# EAGLE schematic AirborneAce (EAGLE 9.6.2)
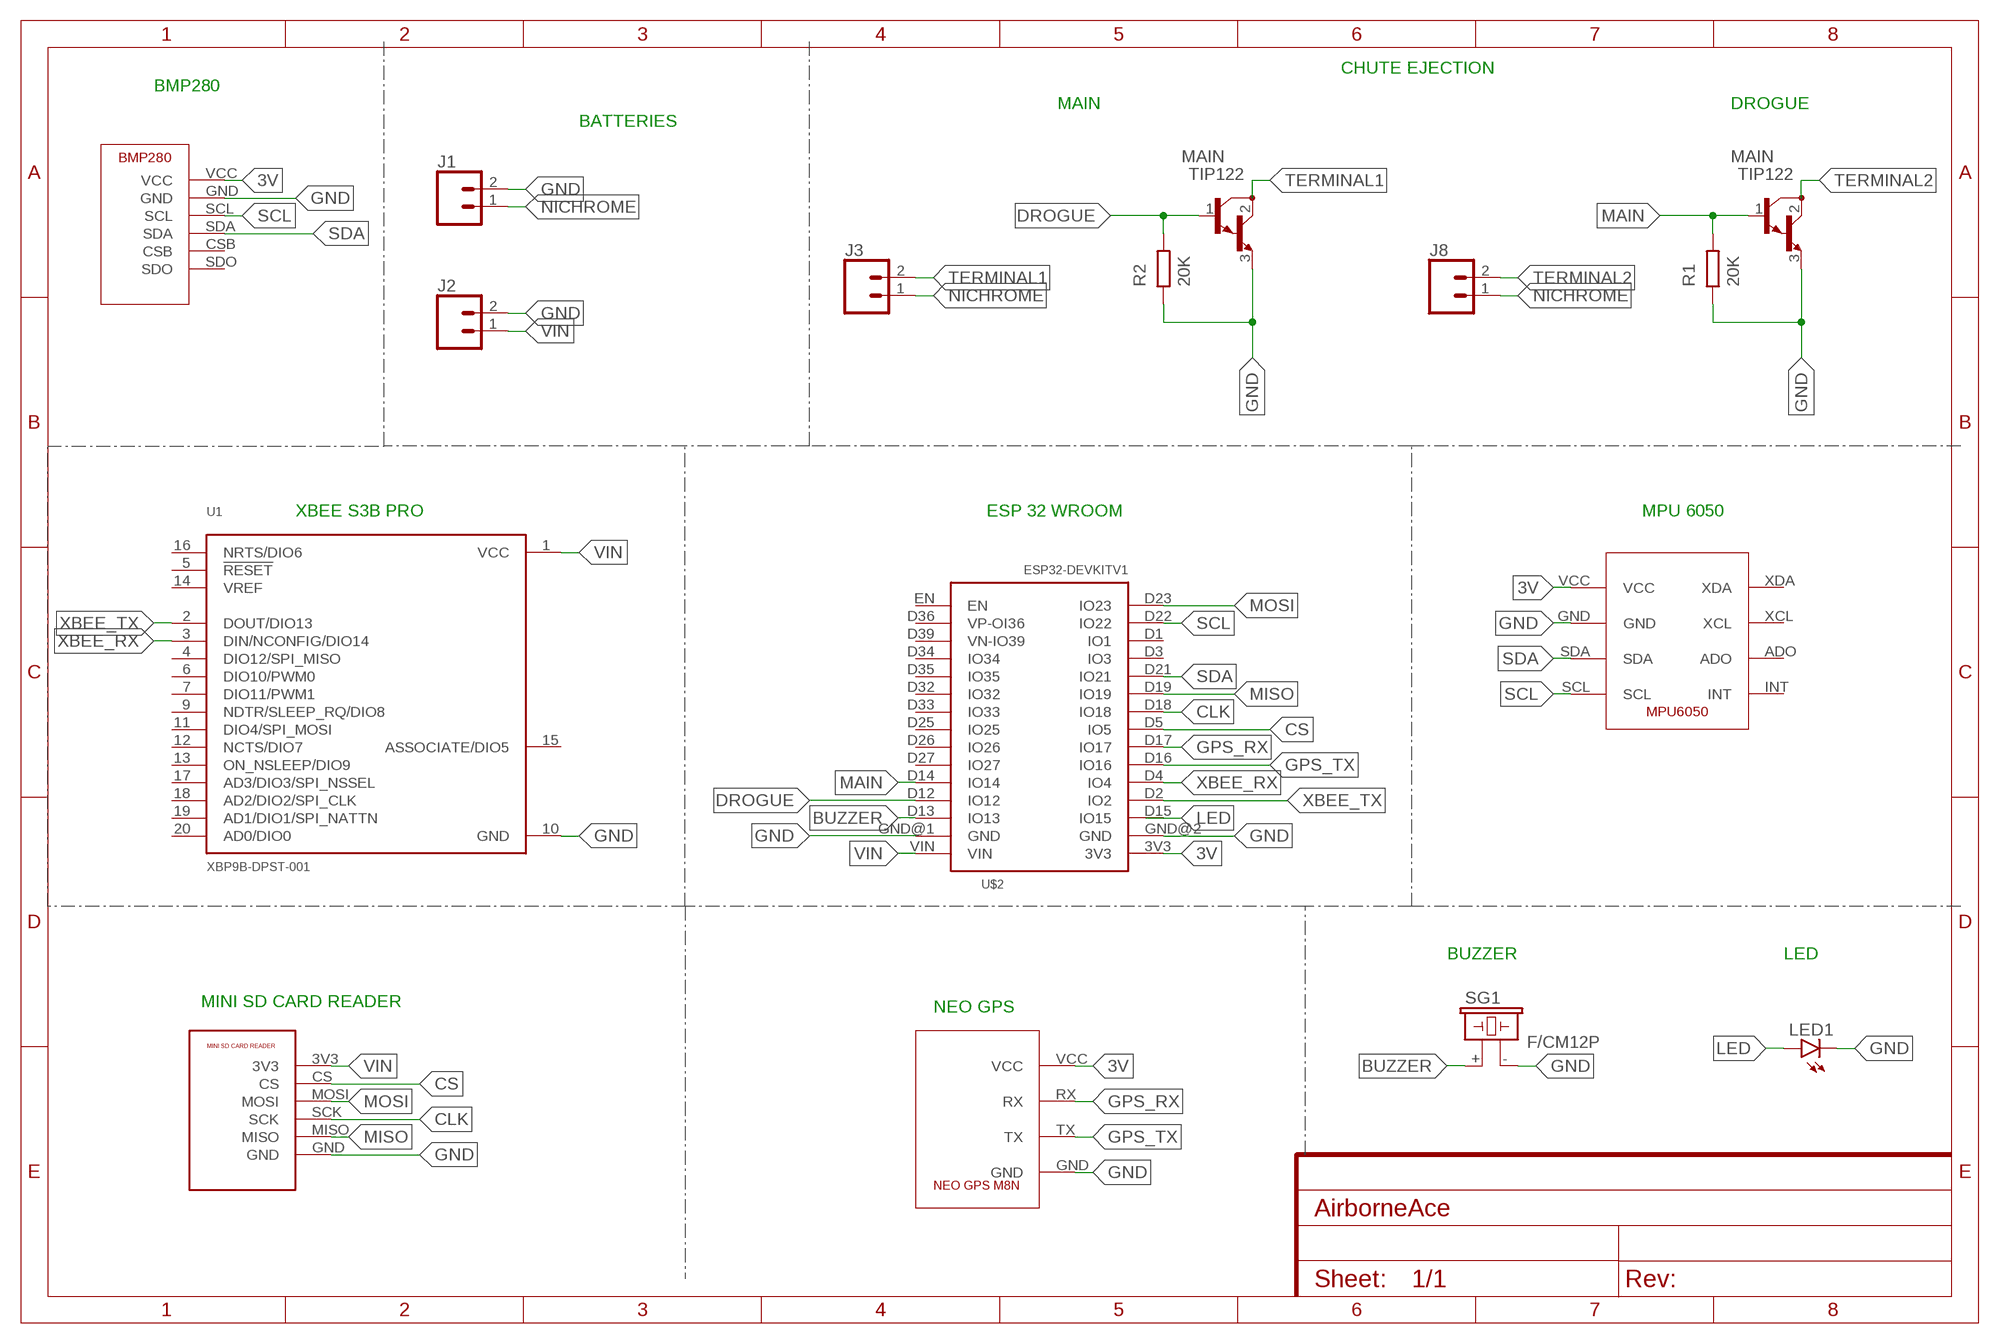
[diagram p0: schematic, sheet 1]

## Parts
J1  CONN_02PTH4  [1X02_XTRA_BIG]
J2  CONN_02PTH4  [1X02_XTRA_BIG]
J3  CONN_02PTH4  [1X02_XTRA_BIG]
J8  CONN_02PTH4  [1X02_XTRA_BIG]
LED1  LED3MM  [LED3MM]
Q1  TIP122  [TO220]
Q2  TIP122  [TO220]
R1  20K  R  (no package)
R2  20K  R  (no package)
SG1  F/CM12P  [F/CM12P]
U1  XBP9B-DPST-001  [DIP2200W51P200L3294H279Q20P]
U$1  MPU6050MPU6050  [MPU6050]
U$2  ESP32DEVKITV1  [ESP32-DEVKITV1]
U$3  NEOGPSM8NNEOGPSM8N  [NEOGPSM8N]
U$4  BMP280BMP280  [BMP280]
U$5  MINISD  [MNISD]

## Nets
3V: U$1.VCC U$2.3V3 U$3.VCC U$4.VCC
BUZZER: SG1.+ U$2.D13(IO13)
CLK: U$2.D18(IO18) U$5.SCK
CS: U$2.D5(IO5) U$5.CS
DROGUE: Q2.1(B) R2.2 U$2.D12(IO12)
GND: J1.2 J2.2 LED1.K(C) Q1.3(E) Q2.3(E) R1.1 R2.1 SG1.- U1.10(GND) U$1.GND U$2.GND@1(GND) U$2.GND@2(GND) U$3.GND U$4.GND U$5.GND
GPS_RX: U$2.D17(IO17) U$3.RX
GPS_TX: U$2.D16(IO16) U$3.TX
LED: LED1.A U$2.D15(IO15)
MAIN: Q1.1(B) R1.2 U$2.D14(IO14)
MISO: U$2.D19(IO19) U$5.MISO
MOSI: U$2.D23(IO23) U$5.MOSI
NICHROME: J1.1 J3.1 J8.1
SCL: U$1.SCL U$2.D22(IO22) U$4.SCL
SDA: U$1.SDA U$2.D21(IO21) U$4.SDA
TERMINAL1: J3.2 Q2.2(C)
TERMINAL2: J8.2 Q1.2(C)
VIN: J2.1 U1.1(VCC) U$2.VIN U$5.3V3
XBEE_RX: U1.3(DIN/NCONFIG/DIO14) U$2.D4(IO4)
XBEE_TX: U1.2(DOUT/DIO13) U$2.D2(IO2)
Unconnected: U1.4(DIO12/SPI_MISO) U1.5(!RESET) U1.6(DIO10/PWM0) U1.7(DIO11/PWM1) U1.9(NDTR/SLEEP_RQ/DIO8) U1.11(DIO4/SPI_MOSI) U1.12(NCTS/DIO7) U1.13(ON_NSLEEP/DIO9) U1.14(VREF) U1.15(ASSOCIATE/DIO5) U1.16(NRTS/DIO6) U1.17(AD3/DIO3/SPI_NSSEL) U1.18(AD2/DIO2/SPI_CLK) U1.19(AD1/DIO1/SPI_NATTN) U1.20(AD0/DIO0) U$1.ADO U$1.INT U$1.XCL U$1.XDA U$2.D1(IO1) U$2.D3(IO3) U$2.D25(IO25) U$2.D26(IO26) U$2.D27(IO27) U$2.D32(IO32) U$2.D33(IO33) U$2.D34(IO34) U$2.D35(IO35) U$2.D36(VP-OI36) U$2.D39(VN-IO39) U$2.EN U$4.CSB U$4.SDO

## Notes on the sheet
- CHUTE EJECTION
- BMP280
- MAIN | DROGUE
- BATTERIES
- XBEE S3B PRO | ESP 32 WROOM | MPU 6050
- BUZZER | LED
- MINI SD CARD READER
- NEO GPS

## Library data of the parts
J1-J3 J8 = SparkFun-Connectors:CONN_02: Multi connection point. Often used as Generic Header-pin footprint for 0.1 inch spaced/style header connections On any of the 0.1 inch spaced packages, you can populate with these: Break Away Headers - Straight <https://www.sparkfun.com/products/116> (PRT-00116) Break Away Male Headers - Right Angle <https://www.sparkfun.com/products/553> (PRT-00553) Female Headers <https://www.sparkfun.com/products/115> (PRT-00115) Break Away Headers - Machine Pin <https://www.sparkfun.com/products/117> (PRT-00117) Break Away Female Headers - Swiss Machine Pin <https://www.sparkfun.com/products/743> (PRT-00743) For SCREWTERMINALS and SPRING TERMINALS visit here: Screw Terimnals on SparkFun.com <https://www.sparkfun.com/search/results?term=Screw+Terminals> (5mm/3.5mm/2.54mm spacing) This device is also useful as a general connection point to wire up your design to another part of your project. Our various solder wires solder well into these plated through hole pads. Hook-Up Wire - Assortment (Stranded, 22 AWG) <https://www.sparkfun.com/products/11375> (PRT-11375) Hook-Up Wire - Assortment (Solid Core, 22 AWG) <https://www.sparkfun.com/products/11367> (PRT-11367) View the entire wire category on our website here <https://www.sparkfun.com/categories/141> Special notes: Molex polarized connector foot print use with: PRT-08233 with associated crimp pins and housings. 2.54_SCREWTERM for use with PRT-10571. 3.5mm Screw Terminal footprints for PRT-08084 5mm Screw Terminal footprints for use with PRT-08432
LED1 = led:LED: LED OSRAM: - CHIPLED LG R971, LG N971, LY N971, LG Q971, LY Q971, LO R971, LY R971 LH N974, LH R974 LS Q976, LO Q976, LY Q976 LO Q996 - Hyper CHIPLED LW Q18S LB Q993, LB Q99A, LB R99A - SideLED LS A670, LO A670, LY A670, LG A670, LP A670 LB A673, LV A673, LT A673, LW A673 LH A674 LY A675 LS A676, LA A676, LO A676, LY A676, LW A676 LS A679, LY A679, LG A679 - Hyper Micro SIDELED® LS Y876, LA Y876, LO Y876, LY Y876 LT Y87S - SmartLED LW L88C, LW L88S LB L89C, LB L89S, LG L890 LS L89K, LO L89K, LY L89K LS L896, LA L896, LO L896, LY L896 - TOPLED LS T670, LO T670, LY T670, LG T670, LP T670 LSG T670, LSP T670, LSY T670, LOP T670, LYG T670 LG T671, LOG T671, LSG T671 LB T673, LV T673, LT T673, LW T673 LH T674 LS T676, LA T676, LO T676, LY T676, LB T676, LH T676, LSB T676, LW T676 LB T67C, LV T67C, LT T67C, LS T67K, LO T67K, LY T67K, LW E67C LS E67B, LA E67B, LO E67B, LY E67B, LB E67C, LV E67C, LT E67C LW T67C LS T679, LY T679, LG T679 LS T770, LO T770, LY T770, LG T770, LP T770 LB T773, LV T773, LT T773, LW T773 LH T774 LS E675, LA E675, LY E675, LS T675 LS T776, LA T776, LO T776, LY T776, LB T776 LHGB T686 LT T68C, LB T68C - Hyper Mini TOPLED® LB M676 - Mini TOPLED Santana® LG M470 LS M47K, LO M47K, LY M47K Source: http://www.osram.convergy.de LUXEON: - LUMILED® LXK2-PW12-R00, LXK2-PW12-S00, LXK2-PW14-U00, LXK2-PW14-V00 LXK2-PM12-R00, LXK2-PM12-S00, LXK2-PM14-U00 LXK2-PE12-Q00, LXK2-PE12-R00, LXK2-PE12-S00, LXK2-PE14-T00, LXK2-PE14-U00 LXK2-PB12-K00, LXK2-PB12-L00, LXK2-PB12-M00, LXK2-PB14-N00, LXK2-PB14-P00, LXK2-PB14-Q00 LXK2-PR12-L00, LXK2-PR12-M00, LXK2-PR14-Q00, LXK2-PR14-R00 LXK2-PD12-Q00, LXK2-PD12-R00, LXK2-PD12-S00 LXK2-PH12-R00, LXK2-PH12-S00 LXK2-PL12-P00, LXK2-PL12-Q00, LXK2-PL12-R00 Source: www.luxeon.com KINGBRIGHT: KA-3528ASYC Source: www.kingbright.com
Q1 Q2 = transistor-npn:TIP122*: NPN Darlington Transistor
R1 R2 = ngspice-simulation:R: RESISTOR
SG1 = buzzer:F/CM12P: BUZZER Source: Buerklin; OC_FARNELL: unknown; OC_NEWARK: unknown
U1 = XBP9B-DPST-001:XBP9B-DPST-001: XBee-PRO 900HP DigiMesh 900 MHz 200 Kbps RF Module with U.FL Connector Check availability <https://pricing.snapeda.com/parts/XBP9B-DPST-001/Digi%20International/view-part?ref=eda>; AVAILABILITY: In Stock; DESCRIPTION: General ISM < 1GHz - Transceiver Module 900MHz Antenna Not Included, RP-SMA Through Hole; MF: Digi International; MP: XBP9B-DPST-001; PACKAGE: Module Digi International; PRICE: None; PURCHASE-URL: https://pricing.snapeda.com/search/part/XBP9B-DPST-001/?ref=eda
U$1 = MPU6050:MPU6050
U$2 = ESP32-DEVKITV1:ESP32DEVKITV1
U$3 = NEOGPSM8N:NEOGPSM8N
U$4 = BMP280:BMP280
U$5 = minisd:MINISD